# Altium schematic sheet Switch_Control.SchDoc
size A4
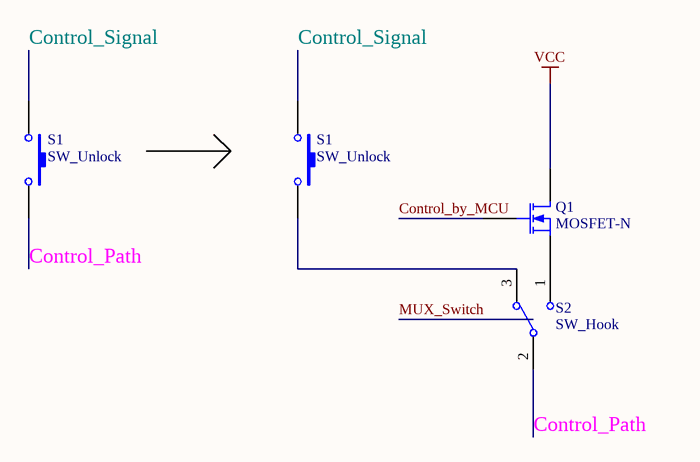
[diagram p0: Switch_Control.SchDoc]

## Parts
(Parts that share a designator on the sheet are numbered #1, #2 ... from top to bottom, then left to right.)
Q1  MOSFET-N  [E3]
S1#1  SW_Unlock  [SPST-2]
S1#2  SW_Unlock  [SPST-2]
S2  SW_Hook  [TL36WW15050]

## Nets
VCC: Q1.1(D)
Control_by_MCU: Q1.2(G)
Control_Path: S1#1.2 S2.2
Control_Signal: S1#1.1 S1#2.1
NetQ1_3: Q1.3(S) S2.1
NetS1#2_2: S1#2.2 S2.3

## Library data of the parts
Q1 = MOSFET-N: N-Channel MOSFET; Published: 8-Jun-2000; LatestRevisionDate: 17-Jul-2002; LatestRevisionNote: Re-released for DXP Platform.; PackageVersion: 1995/1996; PackageReference: E3; Publisher: Altium Limited; PackageDescription: TO, Flat Index; 3 In-Line, Axial Leads; Body Dia. 4.6mm; Lead Dia. 0.5 mm (max)
S1#1 S1#2 = SW-PB: Switch; Published: 24-Mar-1999; LatestRevisionDate: 17-Jul-2002; LatestRevisionNote: Re-released for DXP Platform.; PackageReference: SPST-2; Publisher: Altium Limited; PackageDescription: Switch; 2 Leads
S2 = SW-SPDT: SPDT Subminiature Toggle Switch, Right Angle Mounting, Vertical Actuation; Published: 24-Mar-1999; LatestRevisionDate: 17-Dec-2003; LatestRevisionNote: Schematic revised, PCB Footprint replaced.; DatasheetVersion: 05-Dec-2000; PackageReference: TL36WW15050; Publisher: Altium Limited; PackageDescription: Switch; 4 Leads; ComponentLink1Description: Manufacturer Link; ComponentLink1URL: http://www.apem.com